# EasyEDA Pro project ProPrj_PCB.epro

# Schematic PD Stepper
Board Name: PD Stepper; Create Date: 2026-04-16; Page Name: Sheet_1; Project Name: PCB_PCB_PD-Stepper_2026-04-16; Schematic Name: PD Stepper; Update Date: 2026-04-16; Add into BOM: yes; Company: Your Company; Convert to PCB: yes; Date: 2024-08-27; Draw By: adamscamden2; REV: 1.0; Sheet: 1/1; spicePre: .
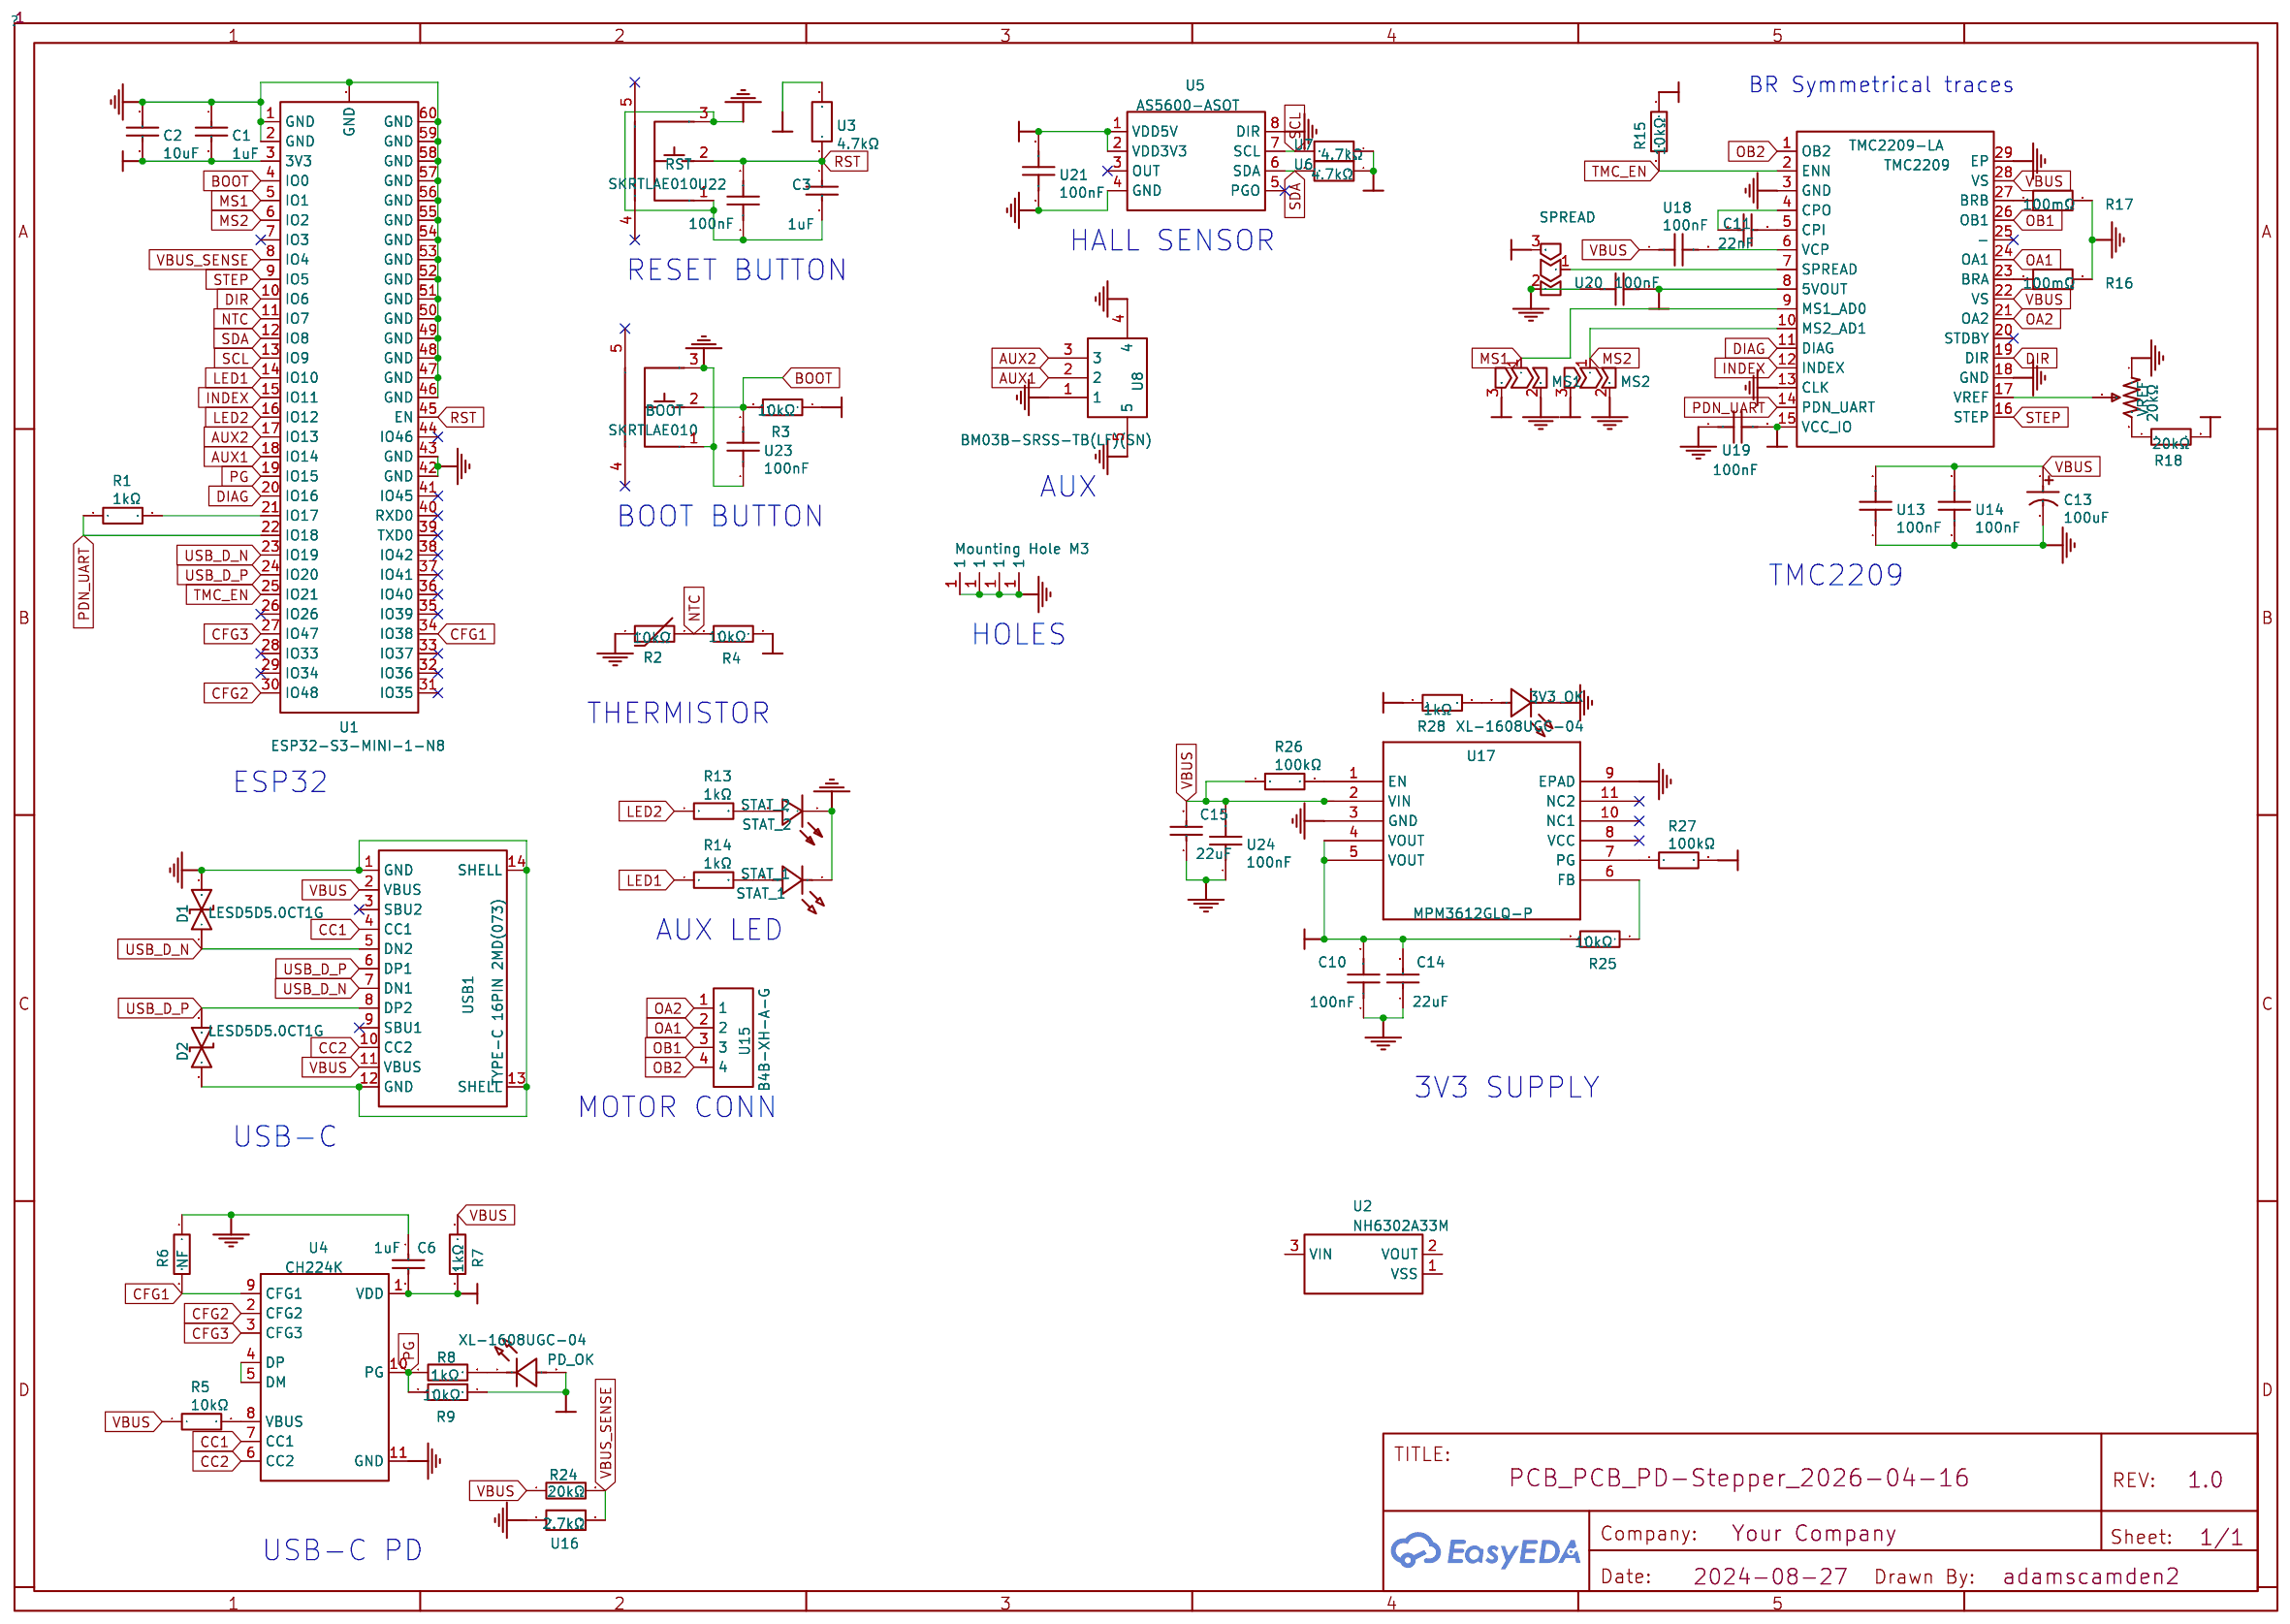
[diagram p0: schematic sheet]

## Parts
3V3_OK  XL-1608UGC-04  [LED0603-RD_GREEN]
BOOT  SKRTLAE010  [KEY-SMD_SKRTLAE010]
C1  1uF  [C0402]
C2  10uF  [C0402]
C3  1uF  [C0402]
C6  1uF  [C0402]
C10  100nF  [C0402]
C11  22nF  [C0805]
C13  100uF  [CAP-SMD_BD6.3-L6.6-W6.6-LS7.6-FD]
C14  22uF  [C0805]
C15  22uF  [C0805]
D1  LESD5D5.0CT1G  [SOD-523_L1.2-W0.8-LS1.6-BI]
D2  LESD5D5.0CT1G  [SOD-523_L1.2-W0.8-LS1.6-BI]
MH1  Mounting Hole M3  [MOUNTING HOLE M3]
MH2  Mounting Hole M3  [MOUNTING HOLE M3]
MH3  Mounting Hole M3  [MOUNTING HOLE M3]
MH4  Mounting Hole M3  [MOUNTING HOLE M3]
MS1  ms1  [SOLDERJUMPER3]
MS2  MS2  [SOLDERJUMPER3]
PD_OK  XL-1608UGC-04  [LED0603-RD_GREEN]
R1  1kΩ  [R0402]
R2  10kΩ  [R0402]
R3  10kΩ  [R0402]
R4  10kΩ  [R0402]
R5  10kΩ  [R0402]
R6  NF  [R0402]
R7  1kΩ  [R0402]
R8  1kΩ  [R0402]
R9  10kΩ  [R0402]
R13  1kΩ  [R0402]
R14  1kΩ  [R0402]
R15  10kΩ  [R0402]
R16  100mΩ  [R2010]
R17  100mΩ  [R2010]
R18  20kΩ  [R0402]
R24  20kΩ  [R0402]
R25  10kΩ  [R0402]
R26  100kΩ  [R0402]
R27  100kΩ  [R0402]
R28  1kΩ  [R0402]
RST  SKRTLAE010  [KEY-SMD_SKRTLAE010]
SPREAD  SPREAD  [SOLDERJUMPER3]
STAT_1  STAT_1  [LED0603-RD_BLUE]
STAT_2  STAT_2  [LED0603-RD]
TMC2209  TMC2209-LA  [QFN-28_L5.0-W5.0-P0.50-BL-EP]
U1  ESP32-S3-MINI-1-N8  [BULETM-SMD_ESP32-S3-MINI-1-N8]
U2  NH6302A33M  [SOT-23-3_L2.9-W1.6-P1.90-LS2.8-BR]
U3  4.7kΩ  [R0402]
U4  CH224K  [ESSOP-10_L4.9-W3.9-P1.0-LS6.0-TL-EP]
U5  AS5600-ASOT  [SOIC-8_L5.0-W4.0-P1.27-LS6.0-BL]
U6  4.7kΩ  [R0402]
U7  4.7kΩ  [R0402]
U8  BM03B-SRSS-TB(LF)(SN)  [CONN-SMD-3P-P1.00_BM03B-SRSS-TB-LF-SN]
U13  100nF  [C0402]
U14  100nF  [C0402]
U15  B4B-XH-A-G  [CONN-TH_B4B-XH-A-G]
U16  2.7kΩ  [R0402]
U17  MPM3612GLQ-P  [DFN-10_L3.0-W3.0-P0.65-BL-EP_MPM3612GLQ-Z]
U18  100nF  [C0402]
U19  100nF  [C0402]
U20  100nF  [C0402]
U21  100nF  [C0402]
U22  100nF  [C0402]
U23  100nF  [C0402]
U24  100nF  [C0402]
USB1  TYPE-C 16PIN 2MD(073)  [USB-C-SMD_TYPE-C-6PIN-2MD-073]
VREF  20kΩ  [RES-ADJ-SMD_TC33X-2-104E]

## Library data of the parts
3V3_OK PD_OK = XL-1608UGC-04: Supplier: LCSC; Supplier Part: C965804; Manufacturer: XINGLIGHT(成兴光); JLCPCB Part Class: Extended Part; Contributor: lcsc; spicePre: L
BOOT RST = SKRTLAE010: Supplier: LCSC; Manufacturer: ALPSALPINE(阿尔卑斯阿尔派); Supplier Part: C110293; JLCPCB Part Class: Extended Part; spicePre: S
C1 C3 C6 = 1uF: Supplier: LCSC; Manufacturer: FH(风华); Manufacturer Part: 0402B102K500NT; Supplier Part: C1523; JLCPCB Part Class: Basic Part; nameAlias: Value; spicePre: C; spiceSymbolName: 0402B102K500NT
C2 = 10uF: Supplier: LCSC; Manufacturer: FH(风华); Manufacturer Part: 0402B102K500NT; Supplier Part: C1523; JLCPCB Part Class: Basic Part; nameAlias: Value; spicePre: C; spiceSymbolName: 0402B102K500NT
C10 = 100nF: Supplier: LCSC; Supplier Part: C1525; Manufacturer: SAMSUNG(三星); Manufacturer Part: CL05B104KO5NNNC; JLCPCB Part Class: Basic Part; nameAlias: Value; spicePre: C; spiceSymbolName: CL05B104KO5NNNC
C11 = 22nF: Supplier: LCSC; Manufacturer Part: CL21B223KBANNNC; Manufacturer: SAMSUNG(三星); Supplier Part: C1729; JLCPCB Part Class: Basic Part; nameAlias: Value; spicePre: C; spiceSymbolName: CL21B223KBANNNC
C13 = 100uF: Supplier: LCSC; Manufacturer: ROQANG(容强); Manufacturer Part: RVT1V101M0607; Supplier Part: C72478; JLCPCB Part Class: Extended Part; nameAlias: Value; spicePre: C; spiceSymbolName: RVT1V101M0607
C14 C15 = 22uF: Supplier: LCSC; Manufacturer: FH(风华); Manufacturer Part: 0805X226M250NT; Supplier Part: C129303; JLCPCB Part Class: Extended Part; nameAlias: Value; spicePre: C; spiceSymbolName: 0805X226M250NT
D1 D2 = LESD5D5.0CT1G: Supplier: LCSC; Supplier Part: C383211; Manufacturer: LRC(乐山无线电); JLCPCB Part Class: Extended Part; Contributor: LCSC; spicePre: D
MH1-MH4 = Mounting Hole M3: Contributor: rexsell; spicePre: M
MS1 = ms1: Contributor: un1tz3r0; spicePre: U; spiceSymbolName: SOLDERJUMPER3 WIDER
MS2 = MS2: Contributor: un1tz3r0; spicePre: U; spiceSymbolName: SOLDERJUMPER3 WIDER
R1 R7 R8 R13 R14 R28 = 1kΩ: Supplier: LCSC; Manufacturer: UNI-ROYAL(厚声); Manufacturer Part: 0402WGF1001TCE; Supplier Part: C11702; JLCPCB Part Class: Basic Part; nameAlias: Value; spicePre: R; spiceSymbolName: 0402WGF1001TCE
R2 = 10kΩ: Supplier: LCSC; Manufacturer: TDK; Manufacturer Part: NTCG104BH103JT1; Supplier Part: C92039; JLCPCB Part Class: Extended Part; nameAlias: Value; spicePre: R; spiceSymbolName: NTCG104BH103JT1
R3-R5 R9 R15 R25 = 10kΩ: Supplier: LCSC; Manufacturer: UNI-ROYAL(厚声); Manufacturer Part: 0402WGF1002TCE; Supplier Part: C25744; JLCPCB Part Class: Basic Part; nameAlias: Value; spicePre: R; spiceSymbolName: 0402WGF1002TCE
R6 = NF: nameAlias: Value; spicePre: R; spiceSymbolName: 0402WGF1002TCE
R16 R17 = 100mΩ: Supplier: LCSC; Supplier Part: C474250; Manufacturer: UNI-ROYAL(厚声); Manufacturer Part: 201007F100LT4E; JLCPCB Part Class: Extended Part; Contributor: LCSC; nameAlias: Value; spicePre: R; spiceSymbolName: 201007F100LT4E
R18 R24 = 20kΩ: Supplier: LCSC; Manufacturer: UNI-ROYAL(厚声); Manufacturer Part: 0402WGF2002TCE; Supplier Part: C25765; JLCPCB Part Class: Basic Part; nameAlias: Value; spicePre: R; spiceSymbolName: 0402WGF2002TCE
R26 R27 = 100kΩ: Supplier: LCSC; Manufacturer: UNI-ROYAL(厚声); Manufacturer Part: 0402WGF1003TCE; Supplier Part: C25741; JLCPCB Part Class: Basic Part; nameAlias: Value; spicePre: R; spiceSymbolName: 0402WGF1003TCE
SPREAD = SPREAD: Contributor: un1tz3r0; spicePre: U; spiceSymbolName: SOLDERJUMPER3 WIDER
STAT_1 = STAT_1: Supplier: LCSC; Supplier Part: C965807; Manufacturer: XINGLIGHT(成兴光); Manufacturer Part: XL-1608UBC-04; JLCPCB Part Class: Extended Part; Contributor: LCSC; spicePre: L; spiceSymbolName: XL-1608UBC-04
STAT_2 = STAT_2: Supplier: LCSC; Manufacturer: KENTO; Manufacturer Part: KT-0603R; Supplier Part: C2286; JLCPCB Part Class: Basic Part; spicePre: L; spiceSymbolName: KT-0603R
TMC2209 = TMC2209-LA: Supplier: LCSC; Supplier Part: C465949; Manufacturer: TRINAMIC; JLCPCB Part Class: Extended Part; Contributor: LCSC; spicePre: U
U1 = ESP32-S3-MINI-1-N8: Supplier: LCSC; Supplier Part: C2913206; Manufacturer: ESPRESSIF(乐鑫); Contributor: lcsc; spicePre: U
U2 = NH6302A33M: Supplier: LCSC; Supplier Part: C7427776; Manufacturer: NH(纽航); JLCPCB Part Class: Extended Part; Contributor: lcsc; spicePre: U
U3 U6 U7 = 4.7kΩ: Supplier: LCSC; Supplier Part: C2906941; Manufacturer: FOJAN(富捷); Manufacturer Part: FRC0402J472 TS; JLCPCB Part Class: Extended Part; Contributor: lcsc; nameAlias: Value; spicePre: U; spiceSymbolName: FRC0402J472 TS
U4 = CH224K: Supplier: LCSC; Supplier Part: C970725; Manufacturer: WCH(南京沁恒); JLCPCB Part Class: Extended Part; Contributor: lcsc; spicePre: U
U5 = AS5600-ASOT: Supplier: LCSC; Supplier Part: C499458; Manufacturer: ams(艾迈斯半导体); JLCPCB Part Class: Extended Part; Contributor: LCSC; spicePre: U
U8 = BM03B-SRSS-TB(LF)(SN): Supplier: LCSC; Supplier Part: C160389; Manufacturer: JST; JLCPCB Part Class: Extended Part; Contributor: LCSC; spicePre: U
U13 U14 U18-U24 = 100nF: Supplier: LCSC; Supplier Part: C343047; Manufacturer: TDK; Manufacturer Part: CGA2B3X7R1V104KT0Y0F; JLCPCB Part Class: Extended Part; Contributor: lcsc; nameAlias: Value; spicePre: U; spiceSymbolName: CGA2B3X7R1V104KT0Y0F
U15 = B4B-XH-A-G: Supplier: LCSC; Supplier Part: C594232; Manufacturer: JST; JLCPCB Part Class: Extended Part; Contributor: LCSC; spicePre: U
U16 = 2.7kΩ: Supplier: LCSC; Supplier Part: C3017488; Manufacturer: VO(翔胜); Manufacturer Part: SCR0402J2K7; JLCPCB Part Class: Extended Part; Contributor: lcsc; nameAlias: Value; spicePre: U; spiceSymbolName: SCR0402J2K7
U17 = MPM3612GLQ-P: Contributor: superslot; spicePre: U
USB1 = TYPE-C 16PIN 2MD(073): Supplier: LCSC; Supplier Part: C2765186; Manufacturer: SHOU HAN(首韩); JLCPCB Part Class: Extended Part; Contributor: LCSC; spicePre: U
VREF = 20kΩ: Supplier: LCSC; Supplier Part: C720648; Manufacturer: BOURNS; Manufacturer Part: TC33X-2-203E; JLCPCB Part Class: Extended Part; nameAlias: Value; Contributor: lcsc; spicePre: R; spiceSymbolName: TC33X-2-203E

## Nets
3V3: C1.2 C2.1 C6.2 C10.2 C14.2 MS1.3 MS2.3 PD_OK.2(A) R3.1 R4.1 R7.2 R9.1 R15.1 R25.2 R27.2 R28.1 SPREAD.3 TMC2209.15(VCC_IO) U1.3(3V3) U3.2 U4.1(VDD) U5.1(VDD5V) U5.2(VDD3V3) U6.1 U7.1 U17.4(VOUT) U17.5(VOUT) U19.2 U21.2
+5V: R18.2 TMC2209.8(5VOUT) U20.1
GND: 3V3_OK.1(K) BOOT.1 BOOT.3 C1.1 C2.2 C3.2 C6.1 C10.1 C13.2 C14.1 C15.1 D1.2 D2.1 MH1.1 MH2.1 MH3.1 MH4.1 MS1.2 MS2.2 R2.1 R6.1 R16.2 R17.2 RST.1 RST.3 SPREAD.2 STAT_1.1(K) STAT_2.1(K) TMC2209.3(GND) TMC2209.13(CLK) TMC2209.18(GND) TMC2209.29(EP) U1.1(GND) U1.2(GND) U1.42(GND) U1.43(GND) U1.46(GND) U1.47(GND) U1.48(GND) U1.49(GND) U1.50(GND) U1.51(GND) U1.52(GND) U1.53(GND) U1.54(GND) U1.55(GND) U1.56(GND) U1.57(GND) U1.58(GND) U1.59(GND) U1.60(GND) U1.GND U4.11(GND) U5.4(GND) U5.8(DIR) U8.1 U8.4 U8.5 U13.1 U14.1 U16.1 U17.3(GND) U17.9(EPAD) U19.1 U20.2 U21.1 U22.1 U23.1 U24.1 USB1.1(GND) USB1.12(GND) USB1.13(SHELL) USB1.14(SHELL) VREF.1
VBUS: C13.1 C15.2 R5.1 R7.1 R24.1 R26.1 TMC2209.22(VS) TMC2209.28(VS) U13.2 U14.2 U17.2(VIN) U18.1 U24.2 USB1.2(VBUS) USB1.11(VBUS)
VBUS_SENSE: R24.2 U1.8(IO4) U16.2
AUX1: U1.18(IO14) U8.2
AUX2: U1.17(IO13) U8.3
BOOT: BOOT.2 R3.2 U1.4(IO0) U23.2
CC1: U4.7(CC1) USB1.4(CC1)
CC2: U4.6(CC2) USB1.10(CC2)
CFG1: R6.2 U1.34(IO38) U4.9(CFG1)
CFG2: U1.30(IO48) U4.2(CFG2)
CFG3: U1.27(IO47) U4.3(CFG3)
DIAG: TMC2209.11(DIAG) U1.20(IO16)
DIR: TMC2209.19(DIR) U1.10(IO6)
INDEX: TMC2209.12(INDEX) U1.15(IO11)
LED1: R14.1 U1.14(IO10)
LED2: R13.1 U1.16(IO12)
MS1: MS1.1 TMC2209.9(MS1_AD0) U1.5(IO1)
MS2: MS2.1 TMC2209.10(MS2_AD1) U1.6(IO2)
NTC: R2.2 R4.2 U1.11(IO7)
OA1: TMC2209.24(OA1) U15.2
OA2: TMC2209.21(OA2) U15.1
OB1: TMC2209.26(OB1) U15.3
OB2: TMC2209.1(OB2) U15.4
PDN_UART: R1.1 TMC2209.14(PDN_UART) U1.22(IO18)
PG: R8.1 R9.2 U1.19(IO15) U4.10(PG)
RST: C3.1 RST.2 U1.45(EN) U3.1 U22.2
SCL: U1.13(IO9) U5.7(SCL) U7.2
SDA: U1.12(IO8) U5.6(SDA) U6.2
STEP: TMC2209.16(STEP) U1.9(IO5)
TMC_EN: R15.2 TMC2209.2(ENN) U1.25(IO21)
USB_D_N: D1.1 U1.23(IO19) USB1.5(DN2) USB1.7(DN1)
USB_D_P: D2.2 U1.24(IO20) USB1.6(DP1) USB1.8(DP2)
Net-(3V3_OK-2): 3V3_OK.2(A) R28.2
Net-(C11-1): C11.1 TMC2209.4(CPO)
Net-(C11-2): C11.2 TMC2209.5(CPI)
Net-(PD_OK-1): PD_OK.1(K) R8.2
Net-(R1-2): R1.2 U1.21(IO17)
Net-(R5-2): R5.2 U4.8(VBUS)
Net-(R13-2): R13.2 STAT_2.2(A)
Net-(R14-2): R14.2 STAT_1.2(A)
Net-(R16-1): R16.1 TMC2209.23(BRA)
Net-(R17-1): R17.1 TMC2209.27(BRB)
Net-(R18-1): R18.1 VREF.3
Net-(R25-1): R25.1 U17.6(FB)
Net-(R26-2): R26.2 U17.1(EN)
Net-(R27-1): R27.1 U17.7(PG)
Net-(SPREAD-1): SPREAD.1 TMC2209.7(SPREAD)
Net-(TMC2209-6): TMC2209.6(VCP) U18.2
Net-(TMC2209-17): TMC2209.17(VREF) VREF.2
Net-(U4-4): U4.4(DP) U4.5(DM)

Not connected (* = marked no-connect by the designer): BOOT 4* 5*; RST 4* 5*; TMC2209 20(STDBY)* 25(-)*; U1 7(IO3)* 26(IO26)* 28(IO33)* 29(IO34)* 31(IO35)* 32(IO36)* 33(IO37)* 35(IO39)* 36(IO40)* 37(IO41)* 38(IO42)* 39(TXD0)* 40(RXD0)* 41(IO45)* 44(IO46)*; U2 1(VSS) 2(VOUT) 3(VIN); U5 3(OUT)* 5(PGO)*; U17 8(VCC)* 10(NC1)* 11(NC2)*; USB1 3(SBU2)* 9(SBU1)*

## Notes on the sheet
- BR Symmetrical traces
- HALL SENSOR
- RESET BUTTON
- AUX
- BOOT BUTTON
- TMC2209
- HOLES
- THERMISTOR
- ESP32
- AUX LED
- 3V3 SUPPLY
- MOTOR CONN
- USB-C
- USB-C PD

# Board PCB_PCB_PD-Stepper_2026-04-16
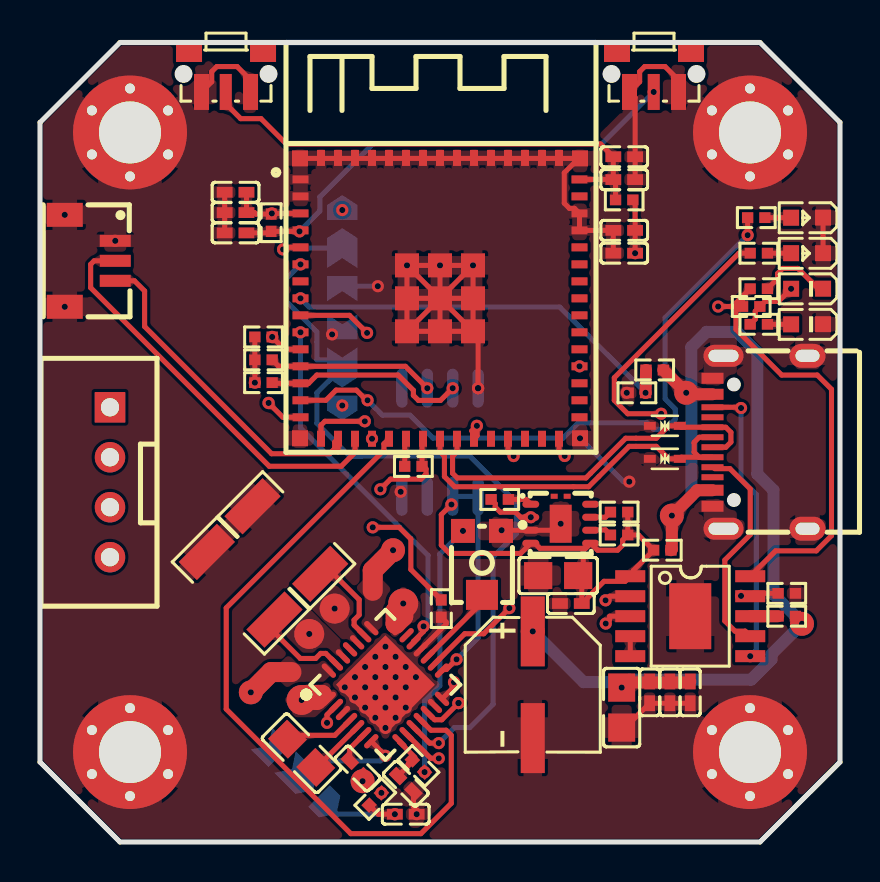
[diagram p1: board, top side]
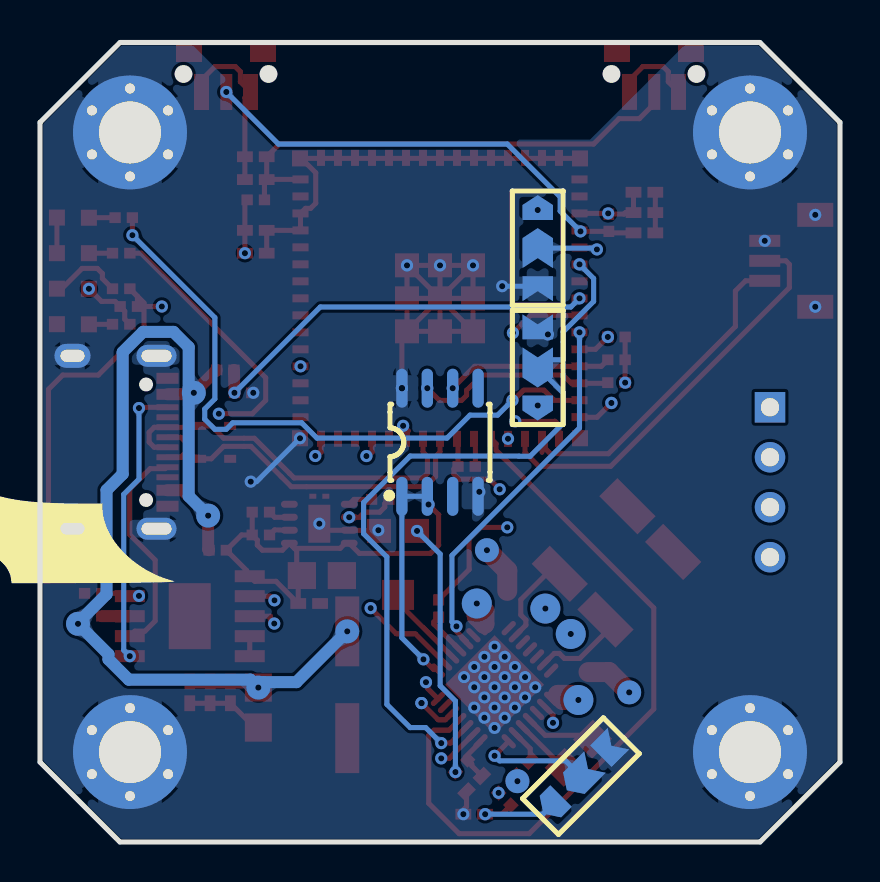
[diagram p2: board, bottom side, seen from below]

Outline 40 x 40 mm; copper layers: Top Layer, Inner1, Inner2, Bottom Layer. Coordinates in mm from the lower left corner of the outline.
Outline path: 0,4 0,36 4,40 36,40 40,36 40,4 36,0 4,0 0,4
Stack: Top Layer 0.035mm / Dielectric1 0.48mm PP er 4.5 / Inner1 0.035mm / Dielectric2 0.48mm FR4 er 4.5 / Inner2 0.035mm / Dielectric3 0.48mm PP er 4.5 / Bottom Layer 0.035mm

## Design rules (mm)
spacing Default (default): track to track 0.152, other pairs 0 to 0.152
spacing Motor: track to track 0.152, other pairs 0 to 0.152
spacing VBUS: track to track 0.152, other pairs 0 to 0.152
track width Default (default): min 0.254, default 0.254, max 25.4
track width Motor: min 1.27, default 1.27, max 25.4
track width VBUS: min 0.6, default 0.6, max 25.4
differential pair differentialPair (default): width min 0.127, default 0.254, max 2.54; gap min 0.152, default 0.152
via Default (default): diameter min 0.61, default 0.61, max 100.025; hole min 0.305, default 0.305, max 59.995
via Motor: diameter min 1.5, default 1.5, max 100.025; hole min 0.305, default 0.305, max 59.995
via VBUS: diameter min 1.2, default 1.2, max 100.025; hole min 0.305, default 0.305, max 59.995
net OA2 uses Motor
net OB2 uses Motor
net OA1 uses Motor
net OB1 uses Motor
net VBUS uses VBUS
pour e53 uses gge59513
pour e136 uses gge59513(1)
pour e852 uses gge75836
pour e854 uses gge75872
pour e856 uses gge75974
pour e858 uses gge76178
pour e861 uses gge76202
pour e863 uses gge76223
pour e865 uses gge78341
pour e867 uses gge59513(2)
pour e1008 uses gge59513(3)

## Placement (name value [footprint] x y rotation side)
3V3_OK  XL-1608UGC-04  [LED0603-RD_GREEN]  38.35 25.9 180 top
BOOT  SKRTLAE010  [KEY-SMD_SKRTLAE010]  30.7 38.5 180 top
C1  1uF  [C0402]  9.78 31.49 0 top
C2  10uF  [C0402]  9.78 32.51 180 top
C3  1uF  [C0402]  29.21 33.14 0 top
C6  1uF  [C0402]  29.21 29.46 0 top
C10  100nF  [C0402]  26.54 11.93 0 top
C11  22nF  [C0805]  13.08 4.44 315 top
C13  100uF  [CAP-SMD_BD6.3-L6.6-W6.6-LS7.6-FD]  24.64 7.87 270 top
C14  22uF  [C0805]  25.91 13.33 0 top
C15  22uF  [C0805]  29.08 6.73 90 top
D1  LESD5D5.0CT1G  [SOD-523_L1.2-W0.8-LS1.6-BI]  31.24 19.17 180 top
D2  LESD5D5.0CT1G  [SOD-523_L1.2-W0.8-LS1.6-BI]  31.24 20.82 0 top
MH1  Mounting Hole M3  [MOUNTING HOLE M3]  4.5 35.5 0 top
MH2  Mounting Hole M3  [MOUNTING HOLE M3]  4.5 4.5 0 top
MH3  Mounting Hole M3  [MOUNTING HOLE M3]  35.5 35.5 0 top
MH4  Mounting Hole M3  [MOUNTING HOLE M3]  35.5 4.5 0 top
MS1  ms1  [SOLDERJUMPER3]  15.11 29.71 0 bottom
MS2  MS2  [SOLDERJUMPER3]  15.11 23.74 180 bottom
PD_OK  XL-1608UGC-04  [LED0603-RD_GREEN]  38.35 27.68 180 top
R1  1kΩ  [R0402]  18.67 18.79 180 top
R2  10kΩ  [R0402]  20.07 11.68 90 top
R3  10kΩ  [R0402]  11.56 30.98 270 top
R4  10kΩ  [R0402]  11.18 25.27 0 top
R5  10kΩ  [R0402]  37.34 11.3 180 top
R6  NF  [R0402]  37.34 12.44 180 top
R7  1kΩ  [R0402]  31.12 14.6 180 top
R8  1kΩ  [R0402]  35.94 27.68 0 top
R9  10kΩ  [R0402]  35.56 26.79 180 top
R13  1kΩ  [R0402]  35.94 29.46 0 top
R14  1kΩ  [R0402]  35.81 31.24 0 top
R15  10kΩ  [R0402]  16.76 2.15 45 top
R16  100mΩ  [R2010]  12.32 15.11 135 top
R17  100mΩ  [R2010]  10.03 12.82 135 top
R18  20kΩ  [R0402]  18.92 3.81 135 top
R24  20kΩ  [R0402]  30.73 23.62 180 top
R25  10kΩ  [R0402]  28.96 15.36 0 top
R26  100kΩ  [R0402]  22.99 17.14 0 top
R27  100kΩ  [R0402]  28.96 16.5 0 top
R28  1kΩ  [R0402]  35.94 25.9 0 top
RST  SKRTLAE010  [KEY-SMD_SKRTLAE010]  9.3 38.5 180 top
SPREAD  SPREAD  [SOLDERJUMPER3]  12.95 3.3 225 bottom
STAT_1  STAT_1  [LED0603-RD_BLUE]  38.35 31.24 180 top
STAT_2  STAT_2  [LED0603-RD]  38.35 29.46 180 top
TMC2209  TMC2209-LA  [QFN-28_L5.0-W5.0-P0.50-BL-EP]  17.27 7.87 315 top
U1  ESP32-S3-MINI-1-N8  [BULETM-SMD_ESP32-S3-MINI-1-N8]  20 27.2 0 top
U3  4.7kΩ  [R0402]  29.21 32.13 0 top
U4  CH224K  [ESSOP-10_L4.9-W3.9-P1.0-LS6.0-TL-EP]  32.51 11.3 270 top
U5  AS5600-ASOT  [SOIC-8_L5.0-W4.0-P1.27-LS6.0-BL]  20 20 180 bottom
U6  4.7kΩ  [R0402]  11.18 24.12 0 top
U7  4.7kΩ  [R0402]  11.18 22.98 0 top
U8  BM03B-SRSS-TB(LF)(SN)  [CONN-SMD-3P-P1.00_BM03B-SRSS-TB-LF-SN]  2.5 29.08 270 top
U13  100nF  [C0402]  30.48 7.49 90 top
U14  100nF  [C0402]  32.51 7.49 90 top
U15  B4B-XH-A-G  [CONN-TH_B4B-XH-A-G]  3.5 18 270 top
U16  2.7kΩ  [R0402]  29.84 22.47 0 top
U17  MPM3612GLQ-P  [DFN-10_L3.0-W3.0-P0.65-BL-EP_MPM3612GLQ-Z]  26.03 16.12 270 top
U18  100nF  [C0402]  15.88 3.68 135 top
U19  100nF  [C0402]  18.29 1.39 180 top
U20  100nF  [C0402]  18.29 2.92 315 top
U21  100nF  [C0402]  29.21 30.6 0 top
U22  100nF  [C0402]  29.21 34.28 180 top
U23  100nF  [C0402]  9.78 30.47 0 top
U24  100nF  [C0402]  31.5 7.49 90 top
USB1  TYPE-C 16PIN 2MD(073)  [USB-C-SMD_TYPE-C-6PIN-2MD-073]  36 20 90 top
VREF  20kΩ  [RES-ADJ-SMD_TC33X-2-104E]  22.1 13.97 180 top

## Footprints (pads in the part's own frame, mm; a bottom-side part is the same pattern mirrored in y, then rotated)
BULETM-SMD_ESP32-S3-MINI-1-N8
  rect 0.8x0.4 smd: 1(-6.975,5.95) 2(-6.975,5.1) 3(-6.975,4.25) 4(-6.975,3.4) 5(-6.975,2.55) 6(-6.975,1.7) 7(-6.975,0.85) 8(-6.975,0) 9(-6.975,-0.85) 10(-6.975,-1.7) 11(-6.975,-2.55) 12(-6.975,-3.4) 13(-6.975,-4.25) 14(-6.975,-5.1) 15(-6.975,-5.95) 31(6.975,-5.95) 32(6.975,-5.1) 33(6.975,-4.25) 34(6.975,-3.4) 35(6.975,-2.55) 36(6.975,-1.7) 37(6.975,-0.85) 38(6.975,0) 39(6.975,0.85) 40(6.975,1.7) 41(6.975,2.55) 42(6.975,3.4) 43(6.975,4.25) 44(6.975,5.1) 45(6.975,5.95)
  rect 0.4x0.8 smd: 16(-5.95,-7.025) 17(-5.1,-7.025) 18(-4.25,-7.025) 19(-3.4,-7.025) 20(-2.55,-7.025) 21(-1.7,-7.025) 22(-0.85,-7.025) 23(0,-7.025) 24(0.85,-7.025) 25(1.7,-7.025) 26(2.55,-7.025) 27(3.4,-7.025) 28(4.25,-7.025) 29(5.1,-7.025) 30(5.95,-7.025) 46(5.95,7.025) 47(5.1,7.025) 48(4.25,7.025) 49(3.4,7.025) 50(2.55,7.025) 51(1.7,7.025) 52(0.85,7.025) 53(0,7.025) 54(-0.85,7.025) 55(-1.7,7.025) 56(-2.55,7.025) 57(-3.4,7.025) 58(-4.25,7.025) 59(-5.1,7.025) 60(-5.95,7.025)
  rect 0.8x0.8 smd: GND(-7,7) GND(-7,-7) GND(7,7) GND(7,-7)
  rect 1.2x1.2 smd: GND(-1.65,1.65) GND(-1.65,0) GND(-1.65,-1.65) GND(0,1.65) GND(0,0) GND(0,-1.65) GND(1.65,1.65) GND(1.65,0) GND(1.65,-1.65)
C0402
  rect 0.79x0.54 smd: 1(-0.545,0) 2(0.545,0)
C0805
  rect 1.41x1.35 smd: 1(-1,0) 2(1,0)
CAP-SMD_BD6.3-L6.6-W6.6-LS7.6-FD
  rect 3.5x1.2 smd: 1(-2.67,0) 2(2.67,0)
CONN-SMD-3P-P1.00_BM03B-SRSS-TB-LF-SN
  rect 0.6x1.55 smd: 1(-1,1.262) 2(0.001,1.262) 3(1,1.262)
  rect 1.2x1.8 smd: 4(2.3,-1.262) 5(-2.3,-1.262)
CONN-TH_B4B-XH-A-G
  rect 1.524x1.524 hole 0.914: 1(-3.75,0)
  round 1.524 hole 0.914: 2(-1.25,0) 3(1.25,0) 4(3.75,0)
DFN-10_L3.0-W3.0-P0.65-BL-EP_MPM3612GLQ-Z
  oval 0.35x0.84 smd: 1(-0.775,-1.495) 2(-0.125,-1.495) 3(0.525,-1.495) 4(1.175,-1.495) 5(1.175,1.495) 6(0.525,1.495) 7(-0.125,1.495) 8(-0.775,1.495)
  rect 1.9x1.1 smd: 9(0.2,0)
  rect 0.25x0.35 smd: 10(-1.175,0.325) 11(-1.175,-0.325)
ESSOP-10_L4.9-W3.9-P1.0-LS6.0-TL-EP
  rect 0.6x1.5 smd: 1(-2,-3) 2(-1,-3) 3(0,-3) 4(1,-3) 5(2,-3) 6(2,3) 7(1,3) 8(0,3) 9(-1,3) 10(-2,3)
  rect 3.3x2.1 smd: 11(0,0)
KEY-SMD_SKRTLAE010
  rect 0.75x1.8 smd: 1(-1.225,0.975) 3(1.225,0.975)
  rect 0.6x1.8 smd: 2(0.015,0.975)
  rect 1.3x0.9 smd: 4(-1.85,-0.975) 5(1.85,-0.975)
LED0603-RD
  rect 0.8x0.8 smd: 1(-0.799,0) 2(0.799,0)
LED0603-RD_BLUE
  rect 0.8x0.8 smd: 1(-0.799,-0.004) 2(0.799,0.004)
LED0603-RD_GREEN
  rect 0.8x0.8 smd: 1(-0.799,-0.004) 2(0.799,0.004)
MOUNTING HOLE M3
  round 0.8 hole 0.5: 1(-1.905,1.1) 1(-1.905,-1.1) 1(0,2.2) 1(0,-2.2) 1(1.905,1.1) 1(1.905,-1.1)
  round 5.7 hole 3.1: 1(0,0)
QFN-28_L5.0-W5.0-P0.50-BL-EP
  oval 0.28x0.9 smd: 1(-1.502,-2.5) 2(-1.001,-2.5) 3(-0.5,-2.5) 4(0,-2.5) 5(0.5,-2.5) 6(1,-2.5) 7(1.501,-2.5) 15(1.501,2.5) 16(1,2.5) 17(0.5,2.5) 18(0,2.5) 19(-0.5,2.5) 20(-1.001,2.5) 21(-1.502,2.5)
  oval 0.9x0.28 smd: 8(2.5,-1.502) 9(2.5,-1.001) 10(2.5,-0.5) 11(2.5,0) 12(2.5,0.5) 13(2.5,1) 14(2.5,1.501) 22(-2.5,1.501) 23(-2.5,1) 24(-2.5,0.5) 25(-2.5,0) 26(-2.5,-0.5) 27(-2.5,-1.001) 28(-2.5,-1.502)
  rect 3.5x3.5 smd: 29(0,0)
R0402
  rect 0.566x0.54 smd: 1(-0.433,0) 2(0.433,0)
R2010
  rect 1.282x2.7 smd: 1(-2.392,0) 2(2.392,0)
RES-ADJ-SMD_TC33X-2-104E
  rect 1.2x1.2 smd: 1(-0.95,-1.6) 3(0.95,-1.6)
  rect 1.6x1.5 smd: 2(0,1.6)
SOD-523_L1.2-W0.8-LS1.6-BI
  rect 0.6x0.4 smd: 1(-0.75,0) 2(0.75,0)
SOIC-8_L5.0-W4.0-P1.27-LS6.0-BL
  oval 0.569x1.95 smd: 1(-1.905,-2.705) 2(-0.635,-2.705) 3(0.635,-2.705) 4(1.905,-2.705) 5(1.905,2.705) 6(0.635,2.705) 7(-0.635,2.705) 8(-1.905,2.705)
SOLDERJUMPER3
  custom 1.524x2 smd: 1(0,0)
  custom 1.524x1.25 smd: 2(0,1.905) 3(0,-1.905)
USB-C-SMD_TYPE-C-6PIN-2MD-073
  rect 0.55x1.1 smd: 1(-3.2,2.375) 2(-2.4,2.375) 11(2.4,2.375) 12(3.2,2.375)
  rect 0.3x1.1 smd: 3(-1.75,2.375) 4(-1.25,2.375) 5(-0.75,2.375) 6(-0.25,2.375) 7(0.25,2.375) 8(0.75,2.375) 9(1.25,2.375) 10(1.75,2.375)
  oval 1.1x2 hole 0.6x1.5: 13(-4.325,1.825) 14(4.325,1.825)
  oval 1.2x1.8 hole 0.6x1.2: 13(-4.325,-2.375) 14(4.325,-2.375)

## Nets
3V3: C1.2 C2.1 C6.2 C10.2 C14.2 MS1.3 MS2.3 PD_OK.2 R3.1 R4.1 R7.2 R9.1 R15.1 R25.2 R27.2 R28.1 SPREAD.3 TMC2209.15 U1.3 U3.2 U4.1 U5.1 U5.2 U6.1 U7.1 U17.4 U17.5 U19.2 U21.2
+5V: R18.2 TMC2209.8 U20.1
GND: 3V3_OK.1 BOOT.1 BOOT.3 C1.1 C2.2 C3.2 C6.1 C10.1 C13.2 C14.1 C15.1 D1.2 D2.1 MH1.1 MH2.1 MH3.1 MH4.1 MS1.2 MS2.2 R2.1 R6.1 R16.2 R17.2 RST.1 RST.3 SPREAD.2 STAT_1.1 STAT_2.1 TMC2209.3 TMC2209.13 TMC2209.18 TMC2209.29 U1.1 U1.2 U1.42 U1.43 U1.46 U1.47 U1.48 U1.49 U1.50 U1.51 U1.52 U1.53 U1.54 U1.55 U1.56 U1.57 U1.58 U1.59 U1.60 U1.GND U4.11 U5.4 U5.8 U8.1 U8.4 U8.5 U13.1 U14.1 U16.1 U17.3 U17.9 U19.1 U20.2 U21.1 U22.1 U23.1 U24.1 USB1.1 USB1.12 USB1.13 USB1.14 VREF.1
VBUS: C13.1 C15.2 R5.1 R7.1 R24.1 R26.1 TMC2209.22 TMC2209.28 U13.2 U14.2 U17.2 U18.1 U24.2 USB1.2 USB1.11
VBUS_SENSE: R24.2 U1.8 U16.2
AUX1: U1.18 U8.2
AUX2: U1.17 U8.3
BOOT: BOOT.2 R3.2 U1.4 U23.2
CC1: U4.7 USB1.4
CC2: U4.6 USB1.10
CFG1: R6.2 U1.34 U4.9
CFG2: U1.30 U4.2
CFG3: U1.27 U4.3
DIAG: TMC2209.11 U1.20
DIR: TMC2209.19 U1.10
INDEX: TMC2209.12 U1.15
LED1: R14.1 U1.14
LED2: R13.1 U1.16
MS1: MS1.1 TMC2209.9 U1.5
MS2: MS2.1 TMC2209.10 U1.6
NTC: R2.2 R4.2 U1.11
OA1: TMC2209.24 U15.2
OA2: TMC2209.21 U15.1
OB1: TMC2209.26 U15.3
OB2: TMC2209.1 U15.4
PD_OK_1: PD_OK.1 R8.2
PDN_UART: R1.1 TMC2209.14 U1.22
PG: R8.1 R9.2 U1.19 U4.10
R28_2: 3V3_OK.2 R28.2
RST: C3.1 RST.2 U1.45 U3.1 U22.2
SCL: U1.13 U5.7 U7.2
SDA: U1.12 U5.6 U6.2
STAT_1_2: R14.2 STAT_1.2
STAT_2_2: R13.2 STAT_2.2
STEP: TMC2209.16 U1.9
TMC2209_4: C11.1 TMC2209.4
TMC2209_5: C11.2 TMC2209.5
TMC2209_6: TMC2209.6 U18.2
TMC2209_7: SPREAD.1 TMC2209.7
TMC2209_17: TMC2209.17 VREF.2
TMC2209_23: R16.1 TMC2209.23
TMC2209_27: R17.1 TMC2209.27
TMC_EN: R15.2 TMC2209.2 U1.25
U1_21: R1.2 U1.21
U4_4: U4.4 U4.5
U4_8: R5.2 U4.8
U17_1: R26.2 U17.1
U17_6: R25.1 U17.6
U17_7: R27.1 U17.7
USB_D_N: D1.1 U1.23 USB1.5 USB1.7
USB_D_P: D2.2 U1.24 USB1.6 USB1.8
VREF_3: R18.1 VREF.3

Pads without a net: BOOT 4 5; RST 4 5; TMC2209 20 25; U1 7 26 28 29 31 32 33 35 36 37 38 39 40 41 44; U5 3 5; U17 8 10 11; USB1 3 9

## Via types
v1: diameter 1.5, hole 0.31, Top Layer to Bottom Layer, 4 vias
v2: diameter 1.2, hole 0.31, Top Layer to Bottom Layer, 8 vias
v3: diameter 0.61, hole 0.31, Top Layer to Bottom Layer, 70 vias
v4: diameter 0.62, hole 0.31, Top Layer to Bottom Layer, 8 vias
v5: diameter 0.61, hole 0.305, Top Layer to Bottom Layer, 13 vias

## Routing (per net, layer and track width the routed paths; a pad name or vN(x,y) marks a point on that pad's centre or on a via; arc(x,y) is an arc through that point)
3V3: length 110.3
  Top Layer w0.254: R25.2 29.92,15.36 30.68,14.6 29.67,13.58 29.67,13.45 29.51,13.3 29.26,13.04 28.2,13.04 C10.2 27.09,13.15 C14.2 27.16,13.58 27.16,14.58 27.53,14.95 ; R25.2 29.13,15.11 29.13,14.85 28.88,14.6 27.88,14.6 27.53,14.95 ; R25.2 R27.2 ; v4(20.57,16.89) 20.07,16.38 20.07,14.85 20.47,14.44 24.03,14.44 U17.4 24.74,14.95 24.99,14.69 27.28,14.69 27.53,14.95 ; v3(10.74,22.98) U6.1 R4.1 ; TMC2209.15 20.16,8.63 20.32,8.63 v3(20.83,9.14) ; v3(29.76,29.46) U21.2 29.76,32.01 29.64,32.13 ; 16.46,1.85 16.91,1.39 17.74,1.39 ; U1.3 v3(11.59,31.45) R3.1 10.79,31.42 10.72,31.49 C1.2 C2.1 ; R28.1 35.76,26.16 35.76,26.56 R9.1 36.25,27.05 36.92,27.05 v3(37.55,27.68)
  Inner1 w0.254: v3(20.83,9.14) 19.05,7.36 19.05,4.31 17.78,3.04 17.78,1.43 v4(17.74,1.39) ; v3(15.11,31.62) 27.6,31.62 v3(29.75,29.46) 31.54,27.68 v3(37.55,27.68)
  Inner2 w0.254: v3(15.11,31.62) 14.94,31.45 v3(11.59,31.45) 11.5,31.36 11.5,31.11 10.74,30.35 v3(10.74,22.98) 11.12,22.6 14.35,22.6 v3(15.11,21.84) 15.56,21.4 15.56,20.34 16.32,19.58 18.35,19.58 20.57,17.36 v4(20.57,16.89)
  Bottom Layer w0.254: 21.97,17.23 U5.1 ; U5.1 21.91,10.22 v3(20.83,9.14) ; U5.1 U5.2 ; 17.74,1.39 14.86,1.39 14.3,1.95
+5V: length 2.2
  Top Layer w0.254: U20.1 18.41,3.81 18.41,3.9 18.62,4.11 ; TMC2209.8 17.98,5 18.75,4.24
GND: length 85.6
  Top Layer w0.254: 18.35,28.85 21.65,25.55 ; 18.35,28.85 18.35,25.55 ; 18.35,28.85 21.65,28.85 ; 21.65,25.55 21.65,28.85 ; 21.65,25.55 18.35,25.55 ; 21.65,25.55 21.91,25.3 v3(21.91,22.7) ; 21.65,28.85 18.35,25.55 ; U20.2 18.67,1.77 18.83,1.61 18.83,1.39 ; 20.07,11.25 20.31,11 20.31,10.91 19.04,9.64 ; 29.08,5.72 29.28,5.93 29.46,5.93 30.48,6.94 32.51,6.94 ; 9.23,32.51 9.23,30.47 ; v3(26.03,15.92) 25.71,15.6 U17.3 23.08,15.6 VREF.1 ; 28.66,29.46 28.66,30.6 U1.42 U1.43 26.72,31.7 26.47,31.7 26.21,31.96 26.21,33.48 26.72,33.99 26.79,33.99 U1.GND U1.GND ; RST.1 10.53,38.12 9.85,38.8 8.84,38.8 8.59,38.54 8.59,38.03 RST.3 ; C3.2 U22.1 29.76,37.24 29.47,37.53 29.98,38.03 29.98,38.54 30.24,38.8 31.25,38.8 31.93,38.12 31.93,37.53 ; v4(20,28.85) U1.GND ; STAT_1.1 STAT_2.1 ; 18.35,27.2 21.65,27.2
  Bottom Layer w0.254: v3(27,20.2) 29.17,18.03 v3(29.46,18.03) ; v3(16.89,27.81) MS1.2
  vias: v3(1.24,31.38) v3(1.24,26.78) v3(3.76,30.08) v3(14.6,25.39) v3(15.24,7.74) v3(15.75,8.25) v3(15.75,7.23) v3(16.26,8.76) v3(16.26,7.74) v3(16.26,6.73) v3(16.76,9.27) v3(16.76,8.25) v3(16.76,7.23) v3(16.76,6.22) v3(17.27,9.77) v3(17.27,8.76) v3(17.27,7.74) v3(17.27,6.73) v3(17.27,5.71) v3(17.78,9.27) v3(17.78,8.25) v3(17.78,7.23) v3(17.78,6.22) v3(18.03,17.52) v3(18.29,8.76) v3(18.29,7.74) v3(18.29,6.73) v3(18.8,8.25) v3(18.83,1.39) v3(23.08,15.6) v3(29.34,22.47) v4(18.35,28.85) v4(21.65,28.85)
VBUS: length 94.9
  Top Layer w0.254: 22.56,17.14 22.76,16.93 22.76,16.76 23.01,16.5 23.78,16.5 24.03,16.25 v3(24.54,16.25)
  Top Layer w0.6: 29.08,7.73 29.34,7.98 32.46,7.98 32.51,8.03 ; USB1.2 32.86,17.6 v2(31.59,16.33) 31.59,14.65 R7.1 ; USB1.11 32.38,22.4 32.31,22.47 31.17,23.62
  Top Layer w1: 16.64,12.57 16.64,13.58 v2(17.65,14.6) ; 12.57,8.5 11.56,8.5 v2(10.54,7.49)
  Inner1 w0.254: v3(24.54,16.25) 24.54,10.92 24.64,10.82 v2(24.64,10.54)
  Inner1 w0.6: v2(10.54,7.49) 14.6,3.42 15.75,3.42 v2(16.13,3.04) ; v2(17.65,14.6) 21.34,10.92 24.26,10.92 v2(24.64,10.54)
  Inner2 w1.27: v2(10.54,7.49) 11.81,8.76 11.81,11.04 15.37,14.6 17.4,14.6
  Bottom Layer w0.6: v2(31.59,16.33) 32.56,17.3 32.56,22.22 v2(32.31,22.47) 32.56,22.73 32.56,24.76 33.33,25.52 34.85,25.52 35.87,24.51 35.87,18.41 36.67,17.6 36.67,12.4 37.94,11.13 37.94,11.07 v2(38.1,10.92) 36.58,9.39 36.58,9.14 35.56,8.12 29.48,8.12 v2(29.08,7.73) 28.81,8 27.18,8 v2(24.64,10.54)
VBUS_SENSE: length 20.4
  Top Layer w0.6: 30.28,22.47 R24.2
  Bottom Layer w0.254: v3(13.03,27.2) 13.46,26.77 25.98,26.77 v3(30.28,22.47)
AUX1: length 20.4
  Top Layer w0.254: U1.18 15.75,19.49 15.06,18.8 11.46,18.8 2.53,27.73 2.53,28.9 2.71,29.08 U8.2
AUX2: length 16.9
  Top Layer w0.254: 3.76,28.08 4.72,28.08 5.23,27.57 5.23,25.79 11.58,19.43 14.48,19.43 14.73,19.68 14.73,20.01 U1.17 14.9,19.5
BOOT: length 23.8
  Top Layer w0.254: U23.2 11.48,30.47 11.56,30.55 12.97,30.55 U1.4
  Bottom Layer w0.254: v3(12.97,30.55) 13.99,31.57 13.99,32.27 16.64,34.92 28.08,34.92 v3(30.69,37.53)
CC1: length 10.9
  Top Layer w0.254: 35.51,10.3 35.26,10.55 34.75,10.55 34.24,11.06 34.24,14.11 35.51,15.38 35.51,17.66 34.5,18.68 33.73,18.68
CC2: length 14.3
  Top Layer w0.254: v3(35.05,21.71) 35.01,21.75 USB1.10
  Bottom Layer w0.254: v3(35.51,9.3) 35.81,9.6 35.81,17.39 35.05,18.16 v3(35.05,21.71)
CFG1: length 16.3
  Top Layer w0.254: 35.51,12.3 35.66,12.44 36.91,12.44
  Inner1 w0.254: v3(35.05,12.31) 32.87,14.49 32.87,17.9 v3(26.97,23.8)
CFG2: length 10.4
  Top Layer w0.254: 29.51,12.3 28.48,12.3 ; v5(26.24,19.31) 26.05,19.5 25.95,19.5 ; 25.95,20.18 25.95,19.5 ; v5(28.28,12.09) 28.48,12.3
  Inner1 w0.254: v5(28.28,12.09) 28.28,17.27 v5(26.24,19.31)
CFG3: length 12.8
  Top Layer w0.254: U4.3 28.48,11.3 28.48,11.12 v5(28.29,10.93) ; v5(23.68,19.31) 23.49,19.5 23.4,19.5 U1.27
  Inner1 w0.254: v5(23.68,19.31) 27.24,15.75 27.24,11.98 v5(28.29,10.93)
DIAG: length 36.6
  Top Layer w0.254: 19.04,6.1 19.55,5.59 20.31,5.59 20.56,5.34 20.56,1.94 19.04,0.42 15.54,0.42 9.31,6.65 9.31,11.71 17.1,19.5 17.2,19.6 17.2,19.92 U1.20
DIR: length 18.4
  Top Layer w0.254: v3(19.18,10.79) 19.18,10.54 18.68,10.04 TMC2209.19
  Bottom Layer w0.254: v3(19.18,10.79) 19.4,11.02 19.4,14.34 13.03,20.72 v3(13.03,25.5)
INDEX: length 23.5
  Top Layer w0.254: U1.15 12.15,21.25 v4(11.43,21.97) ; 20.92,6.95 20.09,6.12 19.73,6.12 TMC2209.12
  Inner2 w0.254: v5(20.93,6.95) 20.59,7.29 20.26,7.29 19.92,7.62 19.92,14.15 17.13,16.95 16.87,16.95 11.85,21.97 v4(11.43,21.97)
LED1: length 32.6
  Top Layer w0.254: 16.38,22.1 16.33,22.1 15.82,22.61 14.8,22.61 14.29,22.1 U1.14 ; 35.38,30.36 35.38,31.24
  Bottom Layer w0.254: v5(16.38,22.1) 17.12,21.36 18.5,21.36 19.65,20.21 26.15,20.21 26.92,20.97 30.36,20.97 30.69,20.65 31.26,20.65 31.76,21.16 31.76,21.66 31.26,22.17 31.26,26.23 v5(35.38,30.36)
LED2: length 44.6
  Top Layer w0.254: R13.1 34.95,29.46 28.72,23.23 28.72,22.1 29.39,21.43 v5(31.06,21.43) ; v5(16.24,21.05) 14.24,21.05 14.05,20.85 ; 14.05,20.18 14.05,20.85
  Inner2 w0.254: v5(31.06,21.43) 31.36,21.73 31.36,23.42 33.14,25.2 33.43,25.2 34.62,26.38 34.62,26.98 34.03,27.57 22.76,27.57 v5(16.24,21.05)
MS1: length 40.2
  Top Layer w0.254: 18.33,5.39 19.54,4.19 v5(19.94,4.19) ; v5(12.15,29.65) 12.24,29.65 12.35,29.75 ; 13.03,29.75 12.35,29.75
  Inner1 w0.254: v5(12.15,29.65) 13.4,29.65 20,23.05 20,21.79 25.4,16.39 25.4,15.57 25.62,15.35 25.62,10.21 20.54,5.13 20.54,4.62 20.29,4.37 20.12,4.37 v5(19.94,4.19)
  Bottom Layer w0.254: MS1.1 12.22,29.71 v5(12.15,29.65)
MS2: length 38
  Top Layer w0.254: v3(19.94,4.95) 19.48,4.95 TMC2209.10
  Bottom Layer w0.254: 16.06,19.31 21.49,19.31 23.82,16.98 23.82,15.43 22.66,14.26 22.66,6.89 21.49,5.72 20.72,5.72 v3(19.94,4.95) ; MS2.1 13.84,22.47 13.84,20.95 15.49,19.3 16.06,19.3 ; MS2.1 14.73,24.12 13.84,24.12 13.84,25.52 12.32,27.05 12.32,28.19 v4(13.03,28.9) ; MS2.1 14.85,23.74
NTC: length 19.1
  Top Layer w0.254: v4(11.61,25.27) 12.23,24.65 13.03,24.65 ; v3(16.64,15.74) 17.96,15.74 18.54,15.16 18.54,13.64 R2.2
  Inner1 w0.254: v4(11.61,25.27) 12.37,24.51 12.37,20.01 v3(16.64,15.74)
OA1: length 14.4
  Inner1 w1.27: v1(14.73,11.68) 7.69,18.72 4.03,18.72 U15.2
OA2: length 21.1
  Top Layer w1: 18.16,11.3 v1(18.16,11.93) 17.78,11.55 17.78,10.92 18.16,11.3
  Inner1 w1.27: v1(18.16,11.93) 8.34,21.75 U15.1
OB1: length 12.6
  Inner1 w1.27: v1(13.46,10.41) 7.12,16.75 U15.3
OB2: length 14.8
  Top Layer w1: 13.84,7.11 v1(13.08,7.11) 13.34,7.36 14.1,7.36 13.84,7.11
  Inner1 w1.27: v1(13.08,7.11) 6.22,13.97 3.78,13.97 U15.4
PD_OK_1: length 3.8
  Top Layer w0.254: 36.37,27.68 36.88,28.19 36.88,28.44 37.13,28.7 37.9,28.7 38.91,27.68 PD_OK.1
PDN_UART: length 17.4
  Top Layer w0.254: 19.15,20.18 19.1,20.13 19.1,18.79 ; v3(20.7,8) 20.61,7.9 20.61,7.67 TMC2209.14 ; 19.23,18.74 19.3,18.66 19.3,18.41 19.05,18.16 17.53,18.16 v3(17.02,17.65)
  Inner2 w0.254: v3(20.7,8) 21.59,8.89 21.59,13.08 v3(17.02,17.65)
PG: length 42.9
  Top Layer w0.254: 35.51,13.3 36.78,14.57 38.81,14.57 39.58,15.33 39.58,22.65 38.86,23.36 37.08,23.36 34.8,25.65 34.8,26.97 R8.1 35.13,27.3 R9.2 v3(33.91,26.79)
  Inner2 w0.254: v3(16.6,20.17) 17.18,20.17 17.23,20.12 20.2,20.12 24.64,24.57 31.69,24.57 v3(33.91,26.79)
R28_2: length 1.2
  Top Layer w0.254: 36.37,25.9 3V3_OK.2
RST: length 25
  Top Layer w0.254: 9.29,37.53 9.29,36.94 10.03,36.19 11.05,36.19 12.32,34.92 28.03,34.92 28.66,34.28 28.66,33.14 28.78,33.03 U3.1 ; 28.66,33.15 U1.45
SCL: length 10.1
  Top Layer w0.254: v3(20.63,22.7) 20.02,22.09 18.92,22.09 18.67,22.35 18.67,22.6 17.91,23.36 13.84,23.36 13.43,22.95 11.64,22.95 U7.2
SDA: length 8.3
  Top Layer w0.254: v3(19.37,22.7) 18.27,23.8 U1.12 11.93,23.8 U6.2
STAT_1_2: length 1.3
  Top Layer w0.254: 37.55,31.24 36.25,31.24
STAT_2_2: length 1.2
  Top Layer w0.254: 36.37,29.46 STAT_2.2
STEP: length 25.3
  Top Layer w0.254: U1.9 15.47,26.35 v5(16.35,25.47) ; TMC2209.16 21.23,10.42 22.18,10.42 v5(23.47,11.7)
  Inner1 w0.254: v5(16.35,25.47) 18.75,23.08 18.75,16.42 v5(23.47,11.7)
TMC2209_4: length 3.5
  Top Layer w0.254: 12.38,5.15 12.57,5.34 14.74,5.34 15.5,6.1
TMC2209_5: length 2.9
  Top Layer w0.254: TMC2209.5 14.08,3.97 14.03,3.97 13.79,3.73
TMC2209_6: length 1.6
  Top Layer w0.254: 15.49,4.06 15.49,4.67 16.21,5.39
TMC2209_7: length 5.8
  Top Layer w0.254: v3(17.27,4.31) 17.07,4.51 16.57,5.04
  Bottom Layer w0.254: v3(17.27,4.31) 17.02,4.06 13.72,4.06 SPREAD.1
TMC2209_17: length 4.3
  Top Layer w0.254: TMC2209.17 22.19,12.08 22.19,12.28 22.1,12.36
TMC2209_23: length 4.8
  Top Layer w0.254: R16.1 14.24,13.65 14.44,13.65 15.96,12.12 15.96,11.36 15.71,11.11 15.71,10.85 16.21,10.35
TMC2209_27: length 4.8
  Top Layer w0.254: R17.1 11.49,10.9 11.49,10.71 13.02,9.18 13.78,9.18 14.03,9.44 14.29,9.44 14.8,8.93
TMC_EN: length 29.8
  Top Layer w0.254: U1.25 21.7,20.46 21.59,20.57 v3(21.84,20.82) ; U1.25 21.84,20.32 ; U1.25 21.84,20.32 ; v3(14.35,5.96) 14.35,6.37 TMC2209.2 ; 21.84,20.32 v3(21.84,20.82) ; 21.84,20.32 v3(21.84,20.82)
  Inner1 w0.254: v3(14.35,5.96) 14.58,5.96 17.07,3.48 v3(17.07,2.46)
  Inner2 w0.254: v3(21.84,20.82) 22.22,20.44 22.22,5.64 19.19,2.61 17.22,2.61 v3(17.07,2.46)
U1_21: length 1.4
  Top Layer w0.254: R1.2 18.24,20.11 U1.21
U4_4: length 1
  Top Layer w0.254: 29.51,9.3 29.51,10.3
U4_8: length 1.4
  Top Layer w0.6: U4.8 36.91,11.3
U17_1: length 1.2
  Top Layer w0.254: R26.2 24.3,17.14 24.54,16.9
U17_6: length 1.1
  Top Layer w0.254: 27.53,15.6 28.27,15.62 R25.1
U17_7: length 1.1
  Top Layer w0.254: 27.53,16.25 28.27,16.25 R27.1
USB_D_N: length 19.3
  Top Layer w0.254: U1.23 20,19.52 20.22,19.3 20.22,18.28 20.73,17.78 27.43,17.78 29.45,19.79 30.82,19.79 31.44,19.17 D1.1 32.07,19.25 USB1.5 32.96,19.25 32.71,19.5 32.71,20 32.96,20.25 33.62,20.25
USB_D_P: length 18.6
  Top Layer w0.254: 20.85,20.18 20.85,19.52 20.63,19.3 20.63,18.45 20.87,18.21 27.3,18.21 29.28,20.2 30.82,20.2 31.44,20.82 D2.2 32.06,20.75 USB1.8 34.29,20.75 34.54,20.5 34.54,20 34.29,19.75 33.62,19.75
VREF_3: length 12.9
  Bottom Layer w0.254: v3(19.23,3.5) 19.23,7.06 19.99,7.82 19.99,14.41 v3(21.15,15.56)

## Copper pours and planes (outline as drawn; the poured copper is in the pictures)
3V3 on Top Layer: 29.97,15.49 30.73,14.73 30.73,14.6 29.84,13.71 29.84,13.58 29.72,13.46 29.21,13.08 28.19,13.08 27.18,12.06 27.18,14.47 27.56,14.85 27.94,14.73 28.83,14.73 29.46,15.36
GND on Top Layer: 17.27,11.55 20.96,7.87 17.27,4.19 13.59,7.87
GND on Top Layer: 40,4 35.94,-0.06 3.93,-0.06 0,3.87 0,36 3.93,39.94 7.49,39.94 12.44,34.99 27.68,34.99 32.63,39.94 36.06,39.94 40,36
GND on Bottom Layer: 40,4.06 35.94,0 3.94,0 0,3.93 0,36.06 3.94,40 7.49,40 12.45,35.05 27.69,35.05 32.64,40 36.07,40 40,36.06
GND on Inner1: 40,4.06 35.94,0 3.94,0 0,3.93 0,36.06 3.94,40 7.49,40 12.45,35.05 27.69,35.05 32.64,40 36.07,40 40,36.06
GND on Inner2: 40,4.06 35.94,0 3.94,0 0,3.93 0,36.06 3.94,40 7.49,40 12.45,35.05 27.69,35.05 32.64,40 36.07,40 40,36.06
VBUS on Top Layer: 18.16,11.93 16.64,13.46 11.68,8.5 13.08,7.11
OA1 on Top Layer: 13.59,11.68 15.88,9.39 16.38,9.9 15.49,10.79 15.49,11.17 15.75,11.42 15.75,12.06 14.86,12.95
OA2 on Top Layer: 17.78,10.28 16.76,11.3 18.16,12.69 18.92,11.93 18.92,11.3
OB1 on Top Layer: 12.06,10.16 13.46,11.55 15.75,9.27 15.24,8.76 14.35,9.65 13.97,9.65 13.72,9.39 13.08,9.39 12.32,10.16
OB2 on Top Layer: 14.86,7.36 14.35,7.87 13.08,7.87 12.32,7.11 12.7,6.73 12.7,6.47 12.83,6.34 13.72,6.34

Small or netless copper shapes (teardrops, artwork), in the pictures only: 301 on Top Layer, 38 on Bottom Layer, 34 on Inner1, 19 on Inner2
